# EAGLE design CSKB (EAGLE 9.3.1)
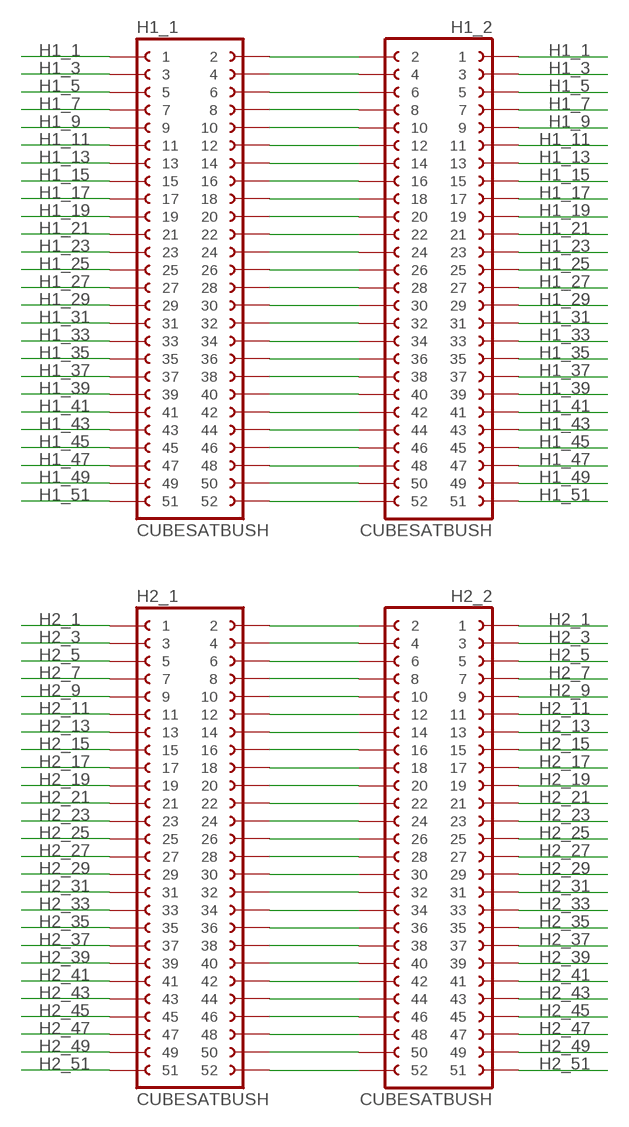
[diagram p0: schematic, sheet 1]

## Parts
H1_1  CUBESATBUSH  [2X26HEADER]
H1_2  CUBESATBUSH  [2X26HEADER]
H2_1  CUBESATBUSH  [2X26HEADER]
H2_2  CUBESATBUSH  [2X26HEADER]

## Nets
H1_1: H1_1.1 H1_2.1
H1_3: H1_1.3 H1_2.3
H1_5: H1_1.5 H1_2.5
H1_7: H1_1.7 H1_2.7
H1_9: H1_1.9 H1_2.9
H1_11: H1_1.11 H1_2.11
H1_13: H1_1.13 H1_2.13
H1_15: H1_1.15 H1_2.15
H1_17: H1_1.17 H1_2.17
H1_19: H1_1.19 H1_2.19
H1_21: H1_1.21 H1_2.21
H1_23: H1_1.23 H1_2.23
H1_25: H1_1.25 H1_2.25
H1_27: H1_1.27 H1_2.27
H1_29: H1_1.29 H1_2.29
H1_31: H1_1.31 H1_2.31
H1_33: H1_1.33 H1_2.33
H1_35: H1_1.35 H1_2.35
H1_37: H1_1.37 H1_2.37
H1_39: H1_1.39 H1_2.39
H1_41: H1_1.41 H1_2.41
H1_43: H1_1.43 H1_2.43
H1_45: H1_1.45 H1_2.45
H1_47: H1_1.47 H1_2.47
H1_49: H1_1.49 H1_2.49
H1_51: H1_1.51 H1_2.51
H2_1: H2_1.1 H2_2.1
H2_3: H2_1.3 H2_2.3
H2_5: H2_1.5 H2_2.5
H2_7: H2_1.7 H2_2.7
H2_9: H2_1.9 H2_2.9
H2_11: H2_1.11 H2_2.11
H2_13: H2_1.13 H2_2.13
H2_15: H2_1.15 H2_2.15
H2_17: H2_1.17 H2_2.17
H2_19: H2_1.19 H2_2.19
H2_21: H2_1.21 H2_2.21
H2_23: H2_1.23 H2_2.23
H2_25: H2_1.25 H2_2.25
H2_27: H2_1.27 H2_2.27
H2_29: H2_1.29 H2_2.29
H2_31: H2_1.31 H2_2.31
H2_33: H2_1.33 H2_2.33
H2_35: H2_1.35 H2_2.35
H2_37: H2_1.37 H2_2.37
H2_39: H2_1.39 H2_2.39
H2_41: H2_1.41 H2_2.41
H2_43: H2_1.43 H2_2.43
H2_45: H2_1.45 H2_2.45
H2_47: H2_1.47 H2_2.47
H2_49: H2_1.49 H2_2.49
H2_51: H2_1.51 H2_2.51
N$1: H1_1.2 H1_2.2
N$2: H1_1.4 H1_2.4
N$3: H1_1.6 H1_2.6
N$4: H1_1.8 H1_2.8
N$5: H1_1.12 H1_2.12
N$6: H1_1.10 H1_2.10
N$7: H1_1.14 H1_2.14
N$8: H1_1.16 H1_2.16
N$9: H1_1.18 H1_2.18
N$10: H1_1.20 H1_2.20
N$11: H1_1.22 H1_2.22
N$12: H1_1.24 H1_2.24
N$13: H1_1.26 H1_2.26
N$14: H1_1.28 H1_2.28
N$15: H1_1.30 H1_2.30
N$16: H1_1.32 H1_2.32
N$17: H1_1.34 H1_2.34
N$18: H1_1.36 H1_2.36
N$19: H1_1.38 H1_2.38
N$20: H1_1.42 H1_2.42
N$21: H1_1.40 H1_2.40
N$22: H1_1.44 H1_2.44
N$23: H1_1.46 H1_2.46
N$24: H1_1.48 H1_2.48
N$25: H1_1.50 H1_2.50
N$26: H1_1.52 H1_2.52
N$27: H2_1.2 H2_2.2
N$28: H2_1.4 H2_2.4
N$29: H2_1.6 H2_2.6
N$30: H2_1.8 H2_2.8
N$31: H2_1.12 H2_2.12
N$32: H2_1.10 H2_2.10
N$33: H2_1.14 H2_2.14
N$34: H2_1.16 H2_2.16
N$35: H2_1.18 H2_2.18
N$36: H2_1.20 H2_2.20
N$37: H2_1.22 H2_2.22
N$38: H2_1.24 H2_2.24
N$39: H2_1.26 H2_2.26
N$40: H2_1.28 H2_2.28
N$41: H2_1.30 H2_2.30
N$42: H2_1.32 H2_2.32
N$43: H2_1.34 H2_2.34
N$44: H2_1.36 H2_2.36
N$45: H2_1.38 H2_2.38
N$46: H2_1.42 H2_2.42
N$47: H2_1.40 H2_2.40
N$48: H2_1.44 H2_2.44
N$49: H2_1.46 H2_2.46
N$50: H2_1.48 H2_2.48
N$51: H2_1.50 H2_2.50
N$52: H2_1.52 H2_2.52

## Library data of the parts
H1_1 H1_2 H2_1 H2_2 = RPI_CAM:CUBESATBUS: Cubesat Kit connector (CSKB) ESQ-126-39-G-D or ESQ-126-38-G-D or SSQ-126-21-G-D or TSW-126-07-G-D (Female part of the connector is on top of the board); MPN: TSW-126-07-G-D

## Board
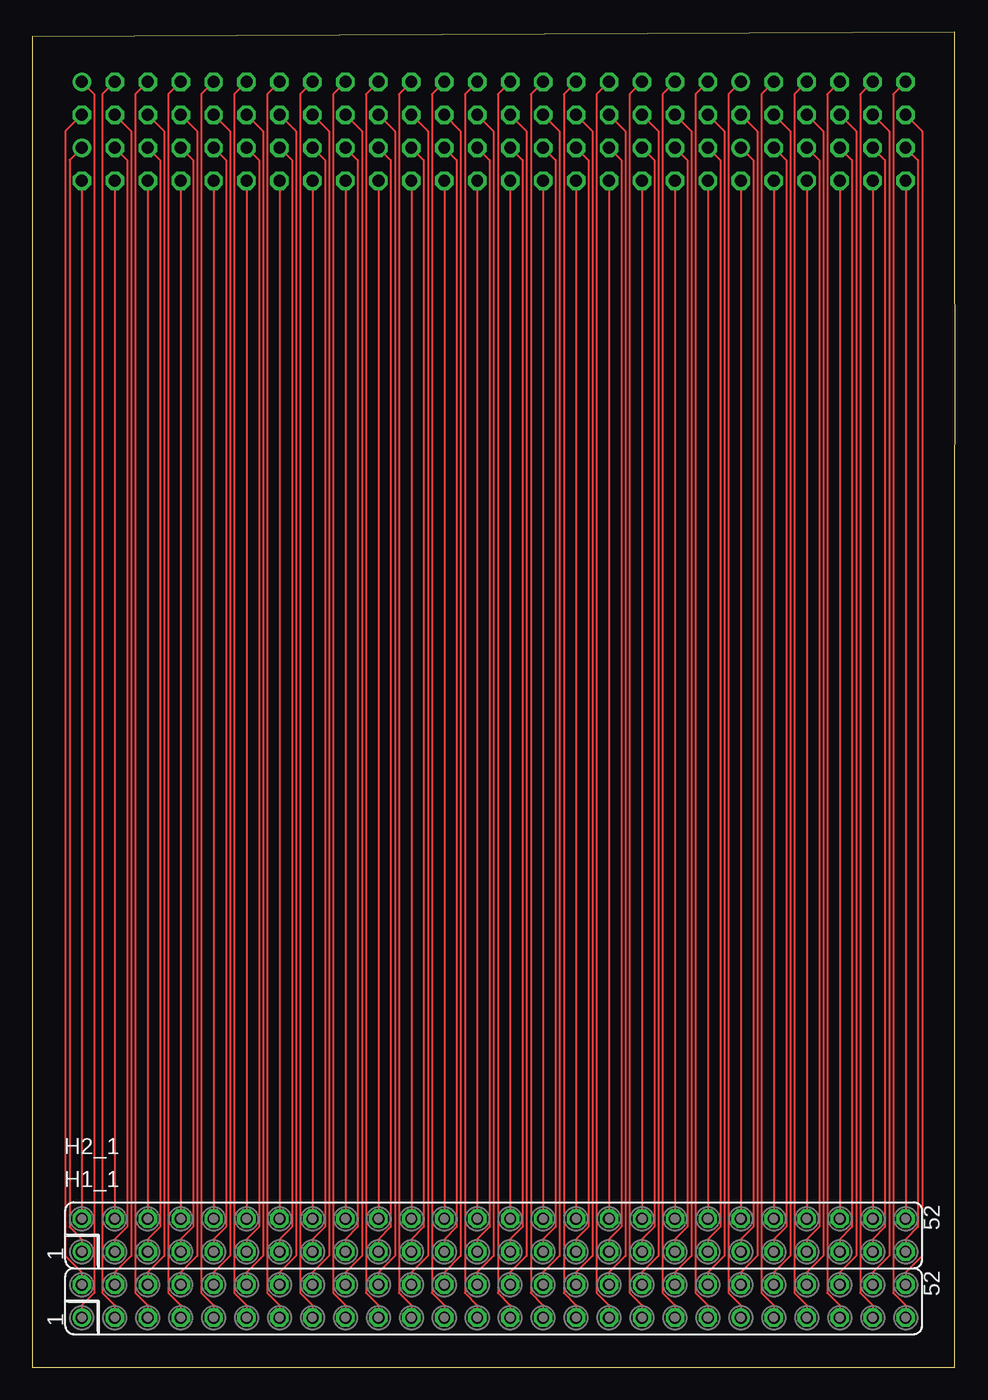
[diagram p1: board, top side]
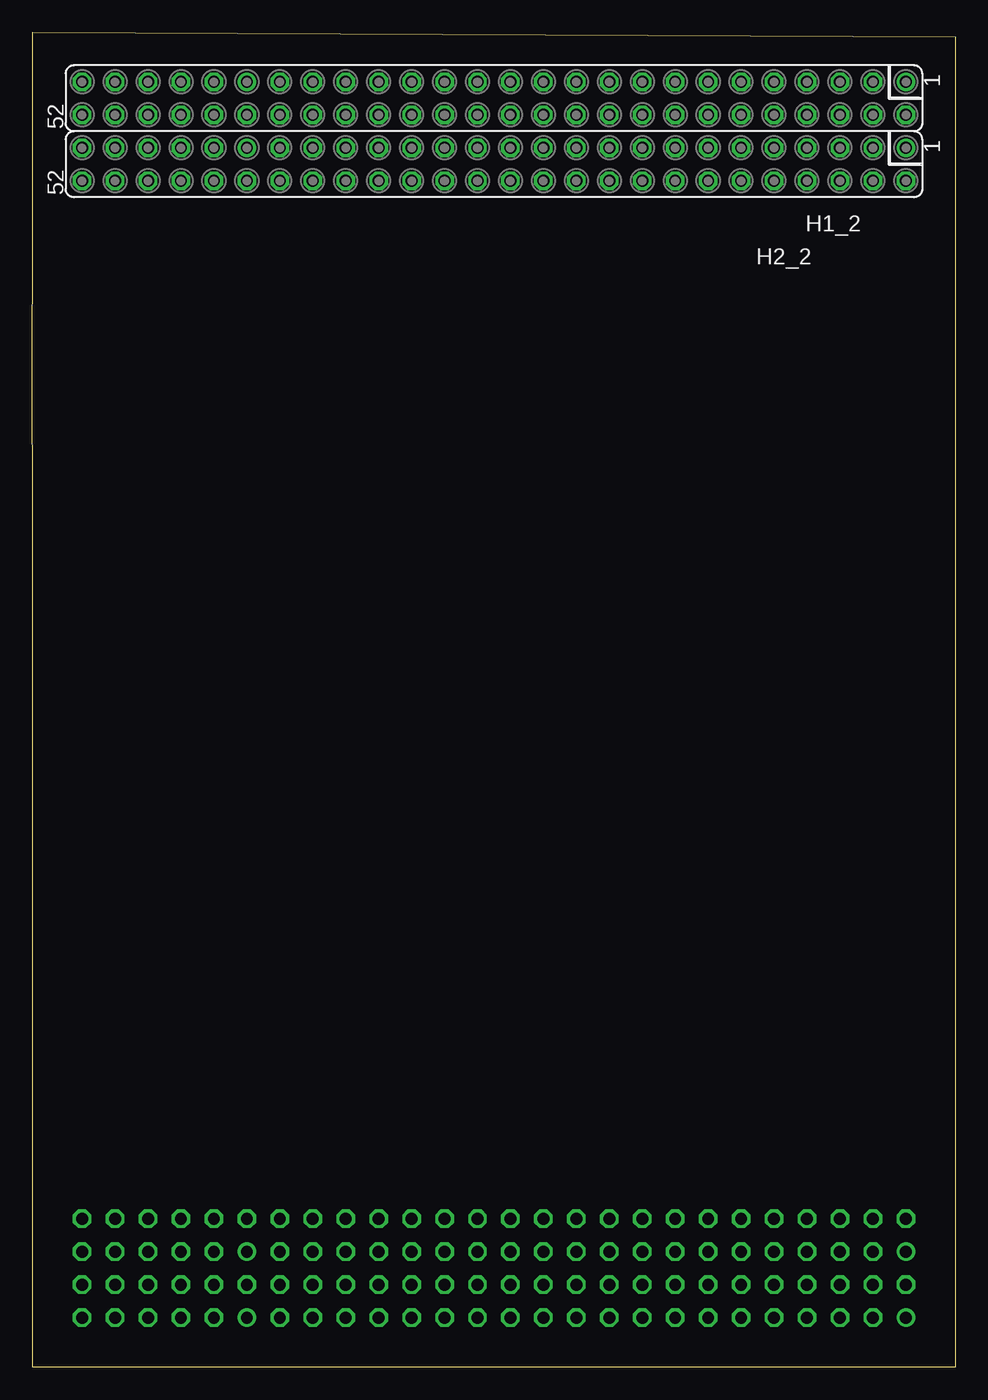
[diagram p2: board, bottom side, seen from below]

Size 71.14 x 102.87 mm. Coordinates in mm from the lower left corner, seen from the top.
Outline: 0,0 71.1,0 71.12,7.62 71.12,63.5 71.14,78.72 71.12,85.09 71.12,102.87 0,102.54 0,0
Copper layers (1*16): Top 0.035mm / dielectric 1.5mm / Bottom 0.035mm
Design rules "SeeedStudio_2layer_DRU_no_angle_20140221": minimum track width 6mil, minimum drill 12mil, track to track 6mil, track to pad 6mil, pad to pad 6mil, via to via 6mil, smd to smd 0mil, copper to edge 10mil, drill to drill 10mil, minimum pad ring 10mil, minimum via ring 6mil, stop-mask expansion 2mil, vias tented up to drill 100mil, thermal gap 10mil

### Footprints (pad centres in the part's own frame; a part is rotated, then mirrored left to right if it is on the bottom)
2X26HEADER = drill 0.914: 1 0,0; 41 50.8,0 | drill 0.914 octagon: 2 0,2.54; 3 2.54,0; 4 2.54,2.54; 5 5.08,0; 6 5.08,2.54; 7 7.62,0; 8 7.62,2.54; 9 10.16,0; 10 10.16,2.54; 11 12.7,0; 12 12.7,2.54; 13 15.24,0; 14 15.24,2.54; 15 17.78,0; 16 17.78,2.54; 17 20.32,0; 18 20.32,2.54; 19 22.86,0; 20 22.86,2.54; 21 25.4,0; 22 25.4,2.54; 23 27.94,0; 24 27.94,2.54; 25 30.48,0; 26 30.48,2.54; 27 33.02,0; 28 33.02,2.54; 29 35.56,0; 30 35.56,2.54; 31 38.1,0; 32 38.1,2.54; 33 40.64,0; 34 40.64,2.54; 35 43.18,0; 36 43.18,2.54; 37 45.72,0; 38 45.72,2.54; 39 48.26,0; 40 48.26,2.54; 42 50.8,2.54; 43 53.34,0; 44 53.34,2.54; 45 55.88,0; 46 55.88,2.54; 47 58.42,0; 48 58.42,2.54; 49 60.96,0; 50 60.96,2.54; 51 63.5,0; 52 63.5,2.54

### Placement (x,y rotation side)
H1_1  3.81,3.81 0 top
H1_2  3.81,99.06 180 bottom
H2_1  3.81,8.89 0 top
H2_2  3.81,93.98 180 bottom

### Tracks (layer width: path | path; a pad name or v marks a point on that pad's centre or on a via)
H1_1
  Top 0.152: H1_1.1 3.81,4.76 4.76,5.71 4.76,98.11 H1_2.1
H1_3
  Top 0.152: H1_1.3 6.35,4.76 5.4,5.71 5.4,98.11 H1_2.3
H1_5
  Top 0.152: H1_1.5 8.89,4.76 7.94,5.71 7.94,98.11 H1_2.5
H1_7
  Top 0.152: H1_1.7 11.43,4.76 10.48,5.71 10.48,98.11 H1_2.7
H1_9
  Top 0.152: H1_1.9 13.97,4.76 13.02,5.71 13.02,98.11 H1_2.9
H1_11
  Top 0.152: H1_1.11 16.51,4.76 15.56,5.71 15.56,98.11 H1_2.11
H1_13
  Top 0.152: H1_1.13 19.05,4.76 18.1,5.71 18.1,98.11 H1_2.13
H1_15
  Top 0.152: H1_1.15 21.59,4.76 20.64,5.71 20.64,98.11 H1_2.15
H1_17
  Top 0.152: H1_1.17 24.13,4.76 23.18,5.71 23.18,98.11 H1_2.17
H1_19
  Top 0.152: H1_1.19 26.67,4.76 25.72,5.71 25.72,98.11 H1_2.19
H1_21
  Top 0.152: H1_1.21 29.21,4.76 28.26,5.71 28.26,98.11 H1_2.21
H1_23
  Top 0.152: H1_1.23 31.75,4.76 30.8,5.71 30.8,98.11 H1_2.23
H1_25
  Top 0.152: H1_1.25 34.29,4.76 33.34,5.71 33.34,98.11 H1_2.25
H1_27
  Top 0.152: H1_1.27 36.83,4.76 35.88,5.71 35.88,98.11 H1_2.27
H1_29
  Top 0.152: H1_1.29 39.37,4.76 38.42,5.71 38.42,98.11 H1_2.29
H1_31
  Top 0.152: H1_1.31 41.91,4.76 40.96,5.71 40.96,98.11 H1_2.31
H1_33
  Top 0.152: H1_1.33 44.45,4.76 43.5,5.71 43.5,98.11 H1_2.33
H1_35
  Top 0.152: H1_1.35 46.99,4.76 46.04,5.71 46.04,98.11 H1_2.35
H1_37
  Top 0.152: H1_1.37 49.53,4.76 48.58,5.71 48.58,98.11 H1_2.37
H1_39
  Top 0.152: H1_1.39 52.07,4.76 51.12,5.71 51.12,98.11 H1_2.39
H1_41
  Top 0.152: H1_1.41 54.61,4.76 53.66,5.71 53.66,98.11 H1_2.41
H1_43
  Top 0.152: H1_1.43 57.15,4.76 56.2,5.71 56.2,98.11 H1_2.43
H1_45
  Top 0.152: H1_1.45 59.69,4.76 58.74,5.71 58.74,98.11 H1_2.45
H1_47
  Top 0.152: H1_1.47 62.23,4.76 61.28,5.71 61.28,98.11 H1_2.47
H1_49
  Top 0.152: H1_1.49 64.77,4.76 63.82,5.71 63.82,98.11 H1_2.49
H1_51
  Top 0.152: H1_1.51 67.31,4.76 66.36,5.71 66.36,98.11 H1_2.51
H2_1
  Top 0.152: H2_1.1 3.81,9.84 2.86,10.79 2.86,93.03 H2_2.1
H2_3
  Top 0.152: H2_1.3 6.35,9.84 7.3,10.79 7.3,93.03 H2_2.3
H2_5
  Top 0.152: H2_1.5 8.89,9.84 9.84,10.79 9.84,93.03 H2_2.5
H2_7
  Top 0.152: H2_1.7 11.43,9.84 12.38,10.79 12.38,93.03 H2_2.7
H2_9
  Top 0.152: H2_1.9 13.97,9.84 14.92,10.79 14.92,93.03 H2_2.9
H2_11
  Top 0.152: H2_1.11 16.51,9.84 17.46,10.79 17.46,93.03 H2_2.11
H2_13
  Top 0.152: H2_1.13 19.05,9.84 20,10.79 20,93.03 H2_2.13
H2_15
  Top 0.152: H2_1.15 21.59,9.84 22.54,10.79 22.54,93.03 H2_2.15
H2_17
  Top 0.152: H2_1.17 24.13,9.84 25.08,10.79 25.08,93.03 H2_2.17
H2_19
  Top 0.152: H2_1.19 26.67,9.84 27.62,10.79 27.62,93.03 H2_2.19
H2_21
  Top 0.152: H2_1.21 29.21,9.84 30.16,10.79 30.16,93.03 H2_2.21
H2_23
  Top 0.152: H2_1.23 31.75,9.84 32.7,10.79 32.7,93.03 H2_2.23
H2_25
  Top 0.152: H2_1.25 34.29,9.84 35.24,10.79 35.24,93.03 H2_2.25
H2_27
  Top 0.152: H2_1.27 36.83,9.84 37.78,10.79 37.78,93.03 H2_2.27
H2_29
  Top 0.152: H2_1.29 39.37,9.84 40.32,10.79 40.32,93.03 H2_2.29
H2_31
  Top 0.152: H2_1.31 41.91,9.84 42.86,10.79 42.86,93.03 H2_2.31
H2_33
  Top 0.152: H2_1.33 44.45,9.84 45.4,10.79 45.4,93.03 H2_2.33
H2_35
  Top 0.152: H2_1.35 46.99,9.84 47.94,10.79 47.94,93.03 H2_2.35
H2_37
  Top 0.152: H2_1.37 49.53,9.84 50.48,10.79 50.48,93.03 H2_2.37
H2_39
  Top 0.152: H2_1.39 52.07,9.84 53.02,10.79 53.02,93.03 H2_2.39
H2_41
  Top 0.152: H2_1.41 54.61,9.84 55.56,10.79 55.56,93.03 H2_2.41
H2_43
  Top 0.152: H2_1.43 57.15,9.84 58.1,10.79 58.1,93.03 H2_2.43
H2_45
  Top 0.152: H2_1.45 59.69,9.84 60.64,10.79 60.64,93.03 H2_2.45
H2_47
  Top 0.152: H2_1.47 62.23,9.84 63.18,10.79 63.18,93.03 H2_2.47
H2_49
  Top 0.152: H2_1.49 64.77,9.84 65.72,10.79 65.72,93.03 H2_2.49
H2_51
  Top 0.152: H2_1.51 67.31,9.84 68.26,10.79 68.26,93.03 H2_2.51
N$1
  Top 0.152: H1_1.2 3.81,7.3 2.54,8.57 2.54,95.25 H1_2.2
N$2
  Top 0.152: H1_1.4 6.35,7.3 7.62,8.57 7.62,95.25 H1_2.4
N$3
  Top 0.152: H1_1.6 8.89,7.3 10.16,8.57 10.16,95.25 H1_2.6
N$4
  Top 0.152: H1_1.8 11.43,7.3 12.7,8.57 12.7,95.25 H1_2.8
N$5
  Top 0.152: H1_1.12 16.51,7.3 17.78,8.57 17.78,95.25 H1_2.12
N$6
  Top 0.152: H1_1.10 13.97,7.3 15.24,8.57 15.24,95.25 H1_2.10
N$7
  Top 0.152: H1_1.14 19.05,7.3 20.32,8.57 20.32,95.25 H1_2.14
N$8
  Top 0.152: H1_1.16 21.59,7.3 22.86,8.57 22.86,95.25 H1_2.16
N$9
  Top 0.152: H1_1.18 24.13,7.3 25.4,8.57 25.4,95.25 H1_2.18
N$10
  Top 0.152: H1_1.20 26.67,7.3 27.94,8.57 27.94,95.25 H1_2.20
N$11
  Top 0.152: H1_1.22 29.21,7.3 30.48,8.57 30.48,95.25 H1_2.22
N$12
  Top 0.152: H1_1.24 31.75,7.3 33.02,8.57 33.02,95.25 H1_2.24
N$13
  Top 0.152: H1_1.26 34.29,7.3 35.56,8.57 35.56,95.25 H1_2.26
N$14
  Top 0.152: H1_1.28 36.83,7.3 38.1,8.57 38.1,95.25 H1_2.28
N$15
  Top 0.152: H1_1.30 39.37,7.3 40.64,8.57 40.64,95.25 H1_2.30
N$16
  Top 0.152: H1_1.32 41.91,7.3 43.18,8.57 43.18,95.25 H1_2.32
N$17
  Top 0.152: H1_1.34 44.45,7.3 45.72,8.57 45.72,95.25 H1_2.34
N$18
  Top 0.152: H1_1.36 46.99,7.3 48.26,8.57 48.26,95.25 H1_2.36
N$19
  Top 0.152: H1_1.38 49.53,7.3 50.8,8.57 50.8,95.25 H1_2.38
N$20
  Top 0.152: H1_1.42 54.61,7.3 55.88,8.57 55.88,95.25 H1_2.42
N$21
  Top 0.152: H1_1.40 52.07,7.3 53.34,8.57 53.34,95.25 H1_2.40
N$22
  Top 0.152: H1_1.44 57.15,7.3 58.42,8.57 58.42,95.25 H1_2.44
N$23
  Top 0.152: H1_1.46 59.69,7.3 60.96,8.57 60.96,95.25 H1_2.46
N$24
  Top 0.152: H1_1.48 62.23,7.3 63.5,8.57 63.5,95.25 H1_2.48
N$25
  Top 0.152: H1_1.50 64.77,7.3 66.04,8.57 66.04,95.25 H1_2.50
N$26
  Top 0.152: H1_1.52 67.31,7.3 68.58,8.57 68.58,95.25 H1_2.52
N$27
  Top 0.152: H2_2.2 H2_1.2
N$28
  Top 0.152: H2_2.4 H2_1.4
N$29
  Top 0.152: H2_2.6 H2_1.6
N$30
  Top 0.152: H2_2.8 H2_1.8
N$31
  Top 0.152: H2_2.12 H2_1.12
N$32
  Top 0.152: H2_2.10 H2_1.10
N$33
  Top 0.152: H2_2.14 H2_1.14
N$34
  Top 0.152: H2_2.16 H2_1.16
N$35
  Top 0.152: H2_2.18 H2_1.18
N$36
  Top 0.152: H2_2.20 H2_1.20
N$37
  Top 0.152: H2_2.22 H2_1.22
N$38
  Top 0.152: H2_2.24 H2_1.24
N$39
  Top 0.152: H2_2.26 H2_1.26
N$40
  Top 0.152: H2_2.28 H2_1.28
N$41
  Top 0.152: H2_2.30 H2_1.30
N$42
  Top 0.152: H2_2.32 H2_1.32
N$43
  Top 0.152: H2_2.34 H2_1.34
N$44
  Top 0.152: H2_2.36 H2_1.36
N$45
  Top 0.152: H2_2.38 H2_1.38
N$46
  Top 0.152: H2_2.42 H2_1.42
N$47
  Top 0.152: H2_2.40 H2_1.40
N$48
  Top 0.152: H2_2.44 H2_1.44
N$49
  Top 0.152: H2_2.46 H2_1.46
N$50
  Top 0.152: H2_2.48 H2_1.48
N$51
  Top 0.152: H2_2.50 H2_1.50
N$52
  Top 0.152: H2_2.52 H2_1.52